# EAGLE design LowVoltageShutdown (EAGLE 8.5.1)
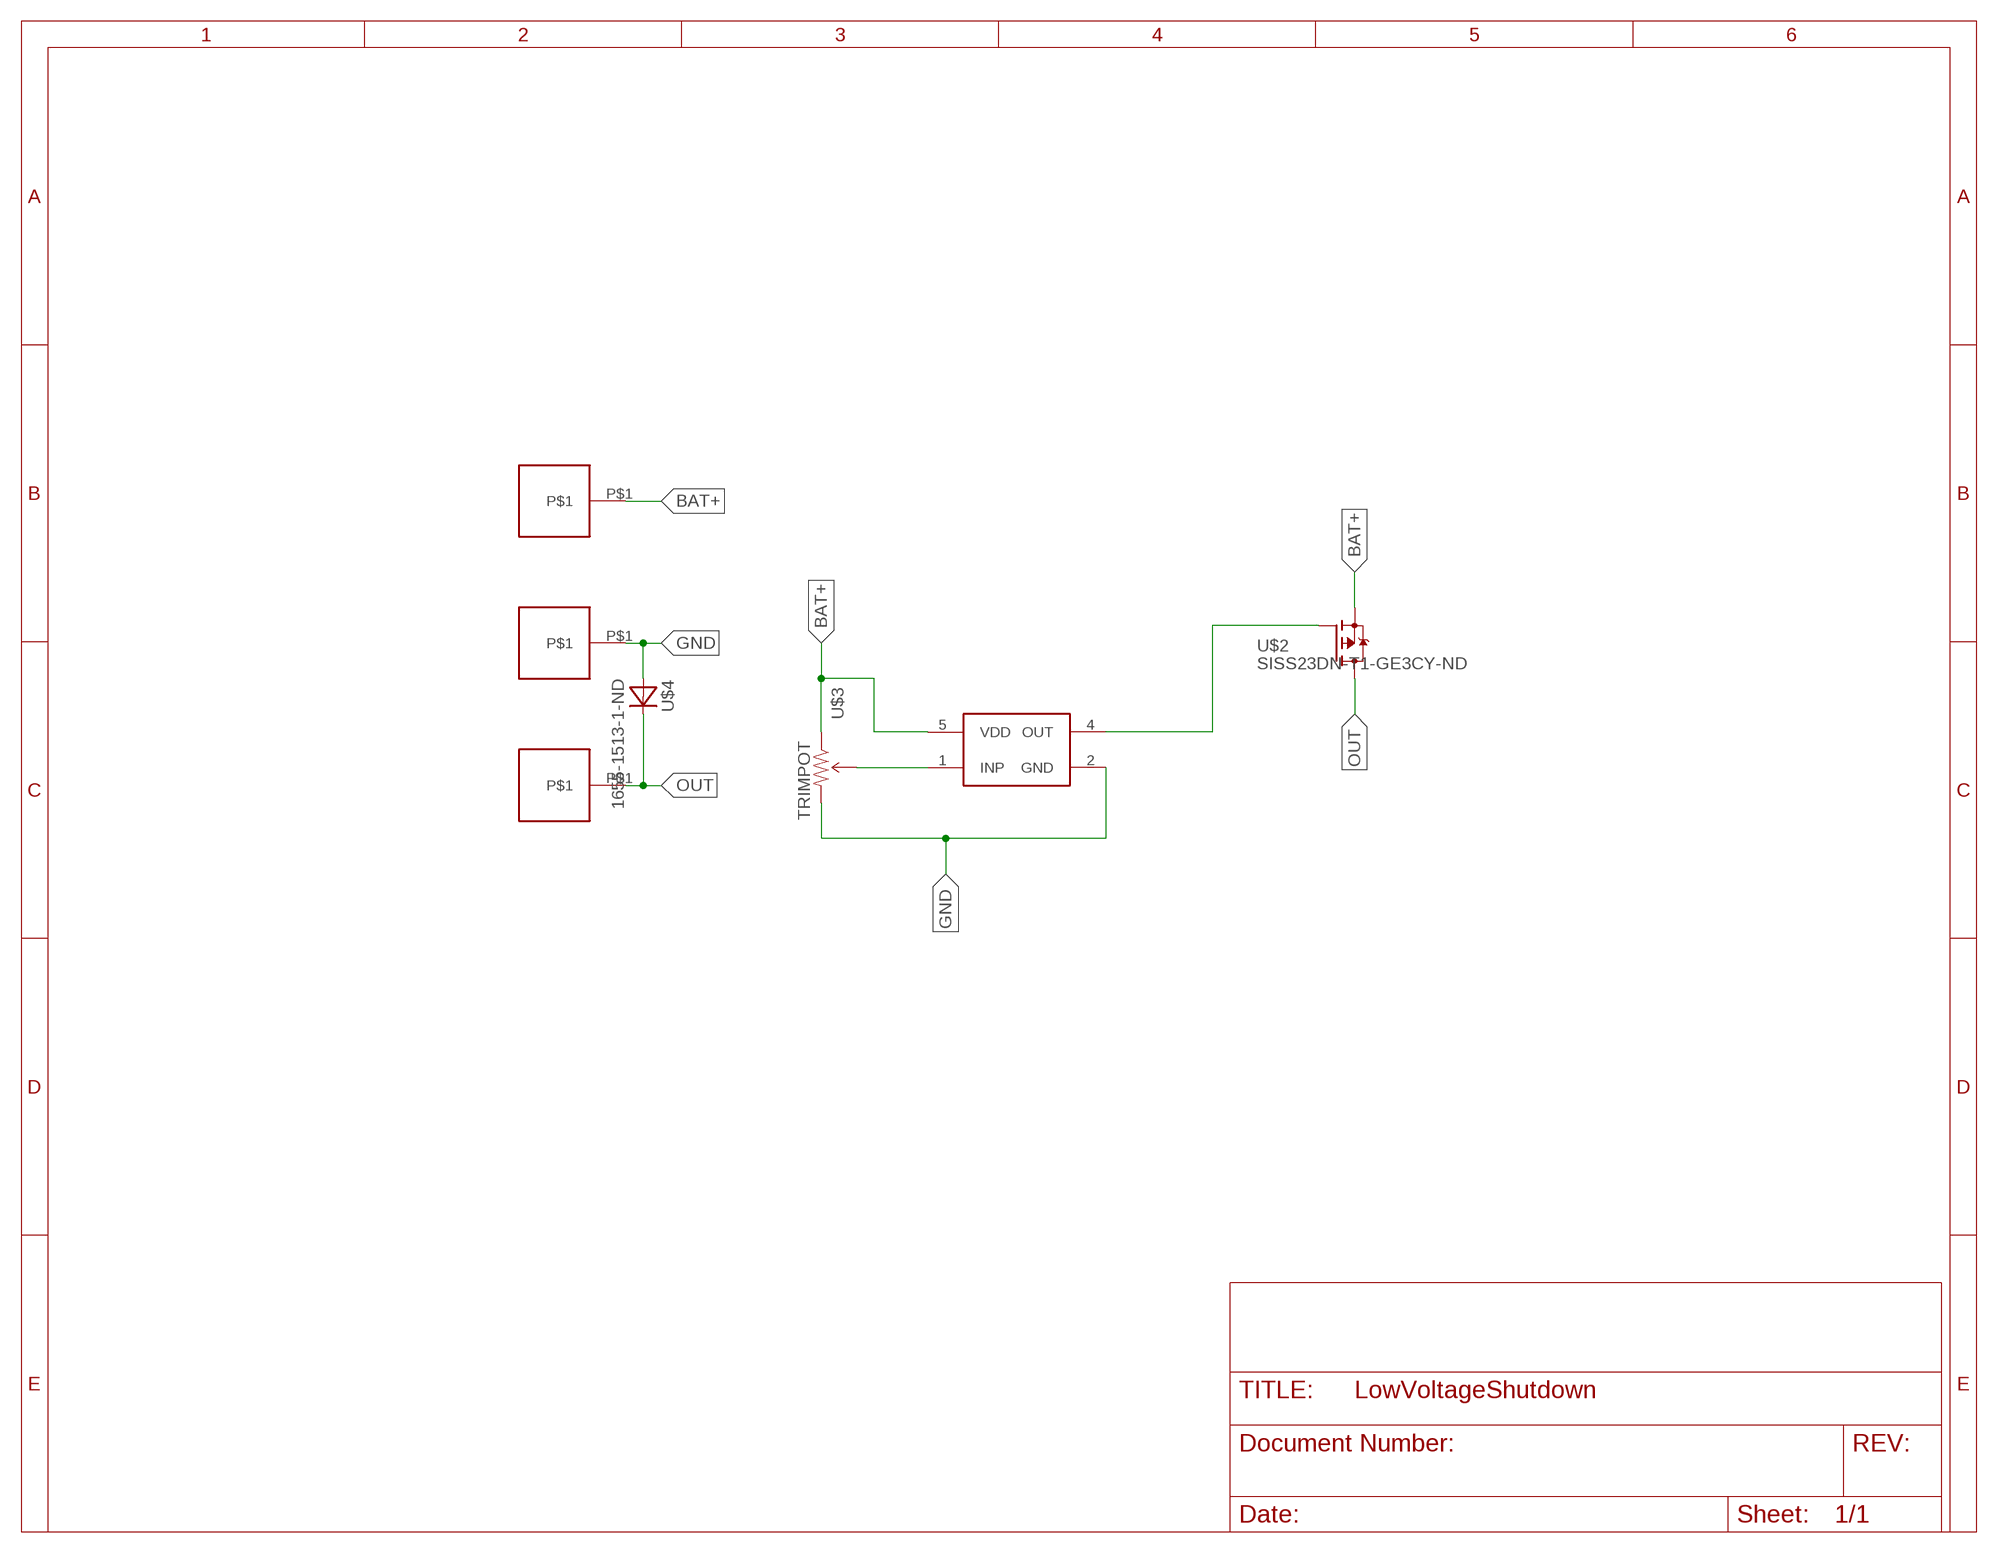
[diagram p0: schematic, sheet 1]

## Parts
BAT+  16G  [16G]
GND  16G  [16G]
OUT  16G  [16G]
U$1  MIC842L  [SC70]
U$2  SISS23DN-T1-GE3CY-ND  [POWERPAK1212-8S]
U$3  TRIMPOT  [490-2877-ND]
U$4  1655-1513-1-ND  [1655-1513-1-ND]

## Nets
BAT+: BAT+.P$1 U$1.5(VDD) U$2.S U$3.P$1(CCW)
GND: GND.P$1 U$1.2(GND) U$3.P$3(CW) U$4.A
N$1: U$1.1(INP) U$3.P$2(WIPER)
N$5: U$1.4(OUT) U$2.G
OUT: OUT.P$1 U$2.D U$4.C

## Library data of the parts
BAT+ GND OUT = Wire2Board:16G
U$1 = MIC842L:MIC842L
U$2 = SISS23DN-T1-GE3CT-ND:SISS23DN-T1-GE3CY-ND
U$3 = trimpot:TRIMPOT
U$4 = 1655-1513-1-ND:1655-1513-1-ND

## Board
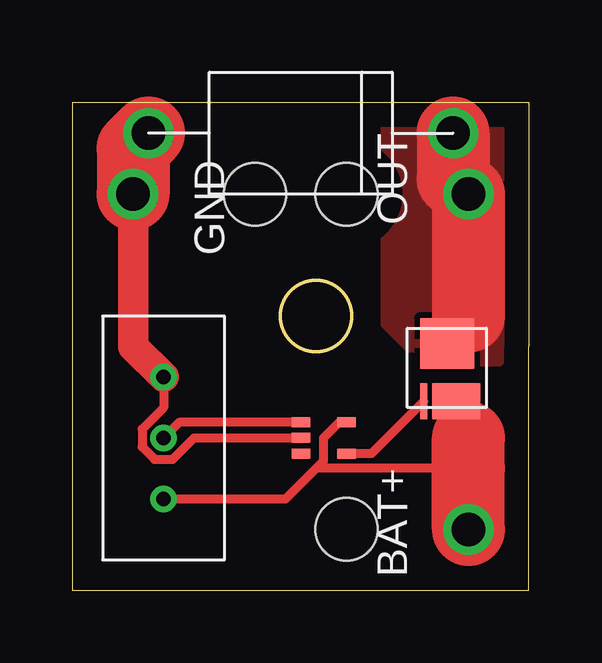
[diagram p1: board, top side]

Size 19.05 x 20.32 mm. Coordinates in mm from the lower left corner, seen from the top.
Outline: 0,0 19.03,0 19.05,20.32 0,20.32 0,0
Outline: circle at 10.16,11.43 radius 1.47
Copper layers (1*16): Top 0.035mm / dielectric 1.5mm / Bottom 0.035mm
Design rules "default": minimum track width 6mil, minimum drill 0.35mm, track to track 6mil, track to pad 6mil, pad to pad 6mil, via to via 6mil, smd to smd 6mil, copper to edge 40mil, drill to drill 6mil, minimum pad ring 10mil, minimum via ring 8mil, stop-mask expansion 4mil, vias tented up to drill 0mil, thermal gap 10mil

### Footprints (pad centres in the part's own frame; a part is rotated, then mirrored left to right if it is on the bottom)
16G = drill 1.4: P$1 0,0 | hole 2.6: 5.08,0
SC70 = smd 0.42 x 0.77: 1 0.65,1.9; 2 0,1.9; 3 -0.65,1.9; 4 -0.65,0; 5 0.65,0
POWERPAK1212-8S = smd 2.25 x 2.11: D 1.65,2.667 | smd 0.3 x 1.5: G 0.675,0.254 | smd 2 x 1.5: S 2.031,0.254
490-2877-ND = drill 0.6: P$1 0,-2.54; P$2 0,0; P$3 0,2.54
1655-1513-1-ND = drill 1.397: A 6.35,0; C -6.35,0

### Placement (x,y rotation side)
BAT+  16.51,2.54 180 top
GND  2.54,16.51 0 top
OUT  16.51,16.51 180 top
U$1  11.43,6.35 90 top
U$2  13.97,7.62 0 top
U$3  3.81,6.35 0 top
U$4  9.53,19.05 180 top

### Tracks (layer width: path | path; a pad name or v marks a point on that pad's centre or on a via)
BAT+
  Top 0.381: U$3.P$1 8.89,3.81 10.16,5.08 | 10.16,5.08 10.48,5.4 10.48,6.35 11.13,7 U$1.5 | 16.51,5.08 10.16,5.08
  Top 1.27: 16.51,6.35 16.51,7.37 U$2.S
  Top 3.048: BAT+.P$1 16.51,5.08 16.51,6.35
GND
  Top 0.381: U$3.P$3 3.81,7.62 2.91,6.72 2.91,5.98 3.44,5.45 4.18,5.45 5.08,6.35 U$1.2
  Top 1.27: GND.P$1 2.54,10.16 U$3.P$3
  Top 3.048: U$4.A 2.54,18.41 GND.P$1
N$1
  Top 0.381: U$1.1 4.46,7 U$3.P$2
N$5
  Top 0.381: U$2.G 12.47,5.7 U$1.4
OUT
  Top 1.27: 16.51,11.43 16.51,11.18 U$2.D
  Top 3.048: 16.51,11.43 OUT.P$1 15.88,17.14 U$4.C
  pour Top: 16.19,9.53 17.78,9.53 18.73,10.48 18.73,20 13.02,20 13.02,11.11 14.61,9.53